# Altium schematic sheet top_power.SchDoc: Electrical Power System - General Block Diagram - Power
size A3; Date: 2015-08-29; Author: Piotr Kuligowski; Revision: 1-0; SheetNumber: 1; SheetTotal: 8; Model: EM1; PageSetup: Record=PageOptions|CenterHorizontal=True|CenterVertical=True|PrintScale=0.52|XCorrection=1.00|YCorrection=1.00|PrintKind=1|BorderSize=5000000|LeftOffset=0|BottomOffset=0|Orientation=2|PaperLength=4200|PaperWidth=2970|Scale=100|PaperSource=7|PrintQuality=600|MediaType=1|DitherType=10|PaperKind=A3|PrintScaleMode=1
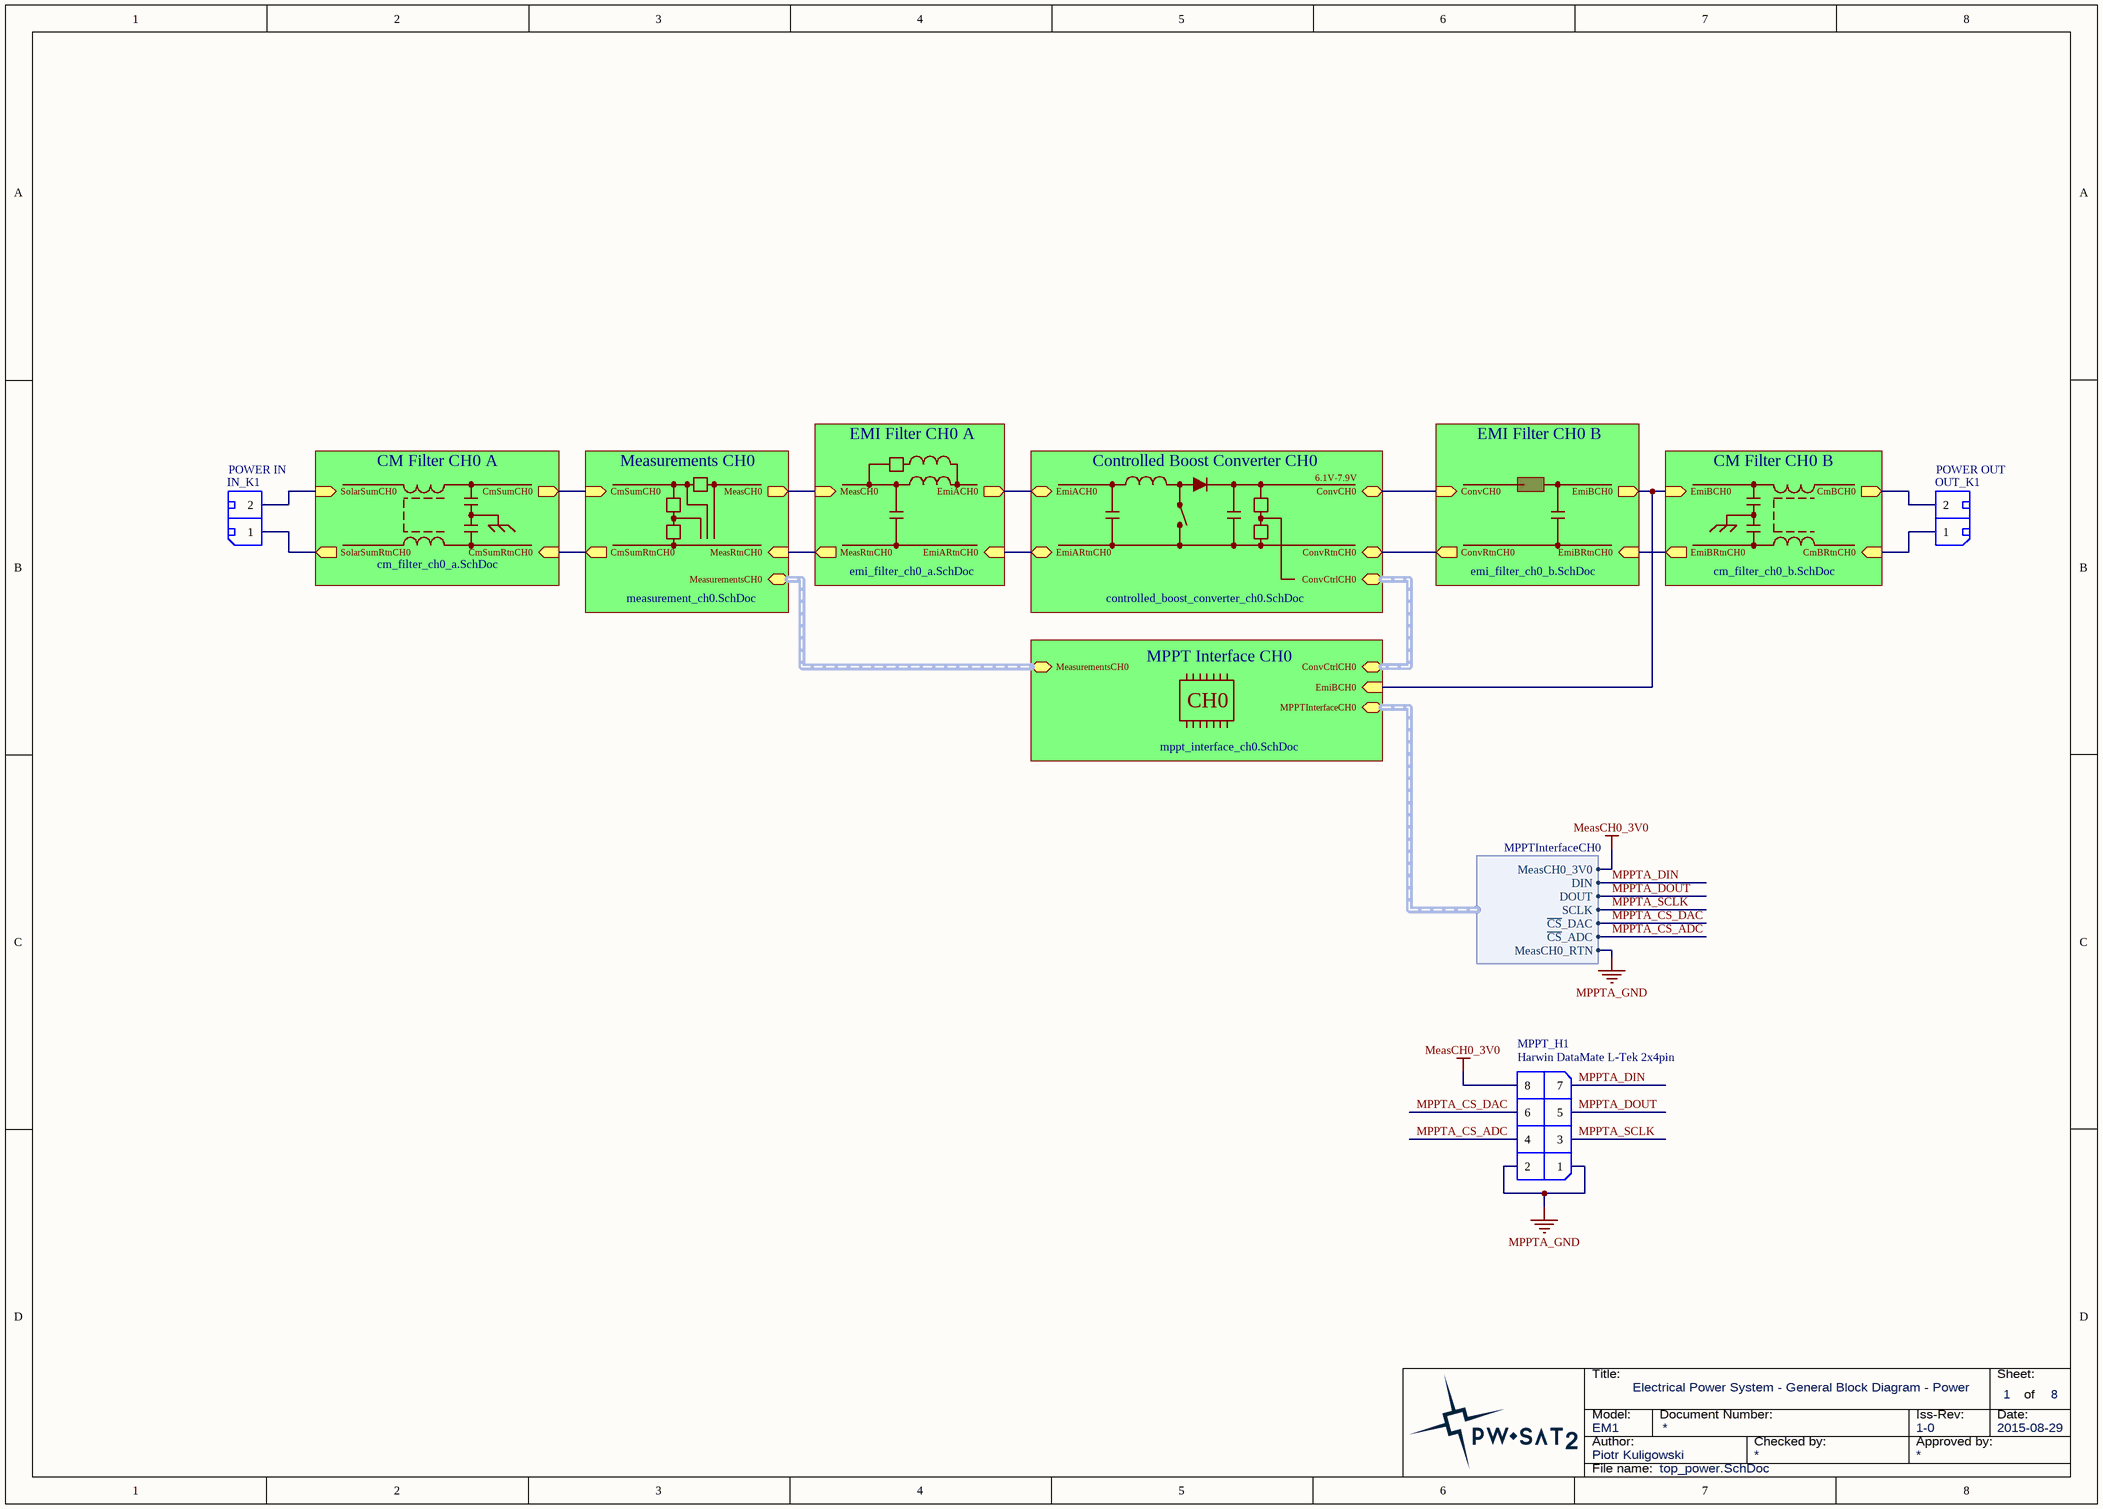
[diagram p0: top_power.SchDoc]

## Parts
IN_K1  ProviderPartNumber: POWER IN  [TerminalBlock_Spring_2.54_2-R]  (hidden comment: TB-2.5-PD-xx)
MPPT_H1  Harwin DataMate L-Tek 2x4pin  [Harwin_Datamate_L-Tek_M80-8670805]
OUT_K1  ProviderPartNumber: POWER OUT  [TerminalBlock_Spring_2.54_2-R]  (hidden comment: TB-2.5-PD-xx)

## Sub-sheets
CM Filter CH0 A = cm_filter_ch0_a.SchDoc: CmSumCH0 (out), CmSumRtnCH0 (in), SolarSumCH0 (in), SolarSumRtnCH0 (out)
CM Filter CH0 B = cm_filter_ch0_b.SchDoc: CmBCH0 (out), CmBRtnCH0 (in), EmiBCH0 (in), EmiBRtnCH0 (out)
Controlled Boost Converter CH0 = controlled_boost_converter_ch0.SchDoc: ConvCH0, ConvRtnCH0, EmiACH0, EmiARtnCH0, ConvCtrlCH0 (harness ConvCtrlCH0)
EMI Filter CH0 A = emi_filter_ch0_a.SchDoc: EmiACH0 (out), EmiARtnCH0 (in), MeasCH0 (in), MeasRtnCH0 (out)
EMI Filter CH0 B = emi_filter_ch0_b.SchDoc: EmiBCH0 (out), EmiBRtnCH0 (in), ConvCH0 (in), ConvRtnCH0 (out)
Measurements CH0 = measurement_ch0.SchDoc: MeasCH0 (out), MeasRtnCH0 (in), CmSumCH0 (in), CmSumRtnCH0 (out), MeasurementsCH0 (harness MeasurementsCH0)
MPPT Interface CH0 = mppt_interface_ch0.SchDoc: MeasurementsCH0 (harness MeasurementsCH0), ConvCtrlCH0 (harness ConvCtrlCH0), MPPTInterfaceCH0 (harness MPPTInterfaceCH0), EmiBCH0 (in)

## Harnesses
MPPTInterfaceCH0: DIN, DOUT, SCLK, ~{CS}_DAC, ~{CS}_ADC, MeasCH0_3V0, MeasCH0_RTN

## Nets
MeasCH0_3V0: MPPT_H1.8 ; sheet MPPT Interface CH0/MPPTInterfaceCH0.MeasCH0_3V0
MPPTA_GND: MPPT_H1.1 MPPT_H1.2 ; sheet MPPT Interface CH0/MPPTInterfaceCH0.MeasCH0_RTN
MPPTA_CS_ADC: MPPT_H1.4 ; sheet MPPT Interface CH0/MPPTInterfaceCH0.~{CS}_ADC
MPPTA_CS_DAC: MPPT_H1.6 ; sheet MPPT Interface CH0/MPPTInterfaceCH0.~{CS}_DAC
MPPTA_DIN: MPPT_H1.7 ; sheet MPPT Interface CH0/MPPTInterfaceCH0.DIN
MPPTA_DOUT: MPPT_H1.5 ; sheet MPPT Interface CH0/MPPTInterfaceCH0.DOUT
MPPTA_SCLK: MPPT_H1.3 ; sheet MPPT Interface CH0/MPPTInterfaceCH0.SCLK
NetIN_K1_1: IN_K1.1 ; sheet CM Filter CH0 A/SolarSumRtnCH0
NetIN_K1_2: IN_K1.2 ; sheet CM Filter CH0 A/SolarSumCH0
NetOUT_K1_1: OUT_K1.1 ; sheet CM Filter CH0 B/CmBRtnCH0
NetOUT_K1_2: OUT_K1.2 ; sheet CM Filter CH0 B/CmBCH0
(unnamed): sheet Controlled Boost Converter CH0/ConvCH0, sheet EMI Filter CH0 B/ConvCH0
(unnamed): sheet Controlled Boost Converter CH0/ConvRtnCH0, sheet EMI Filter CH0 B/ConvRtnCH0
(unnamed): sheet Controlled Boost Converter CH0/EmiACH0, sheet EMI Filter CH0 A/EmiACH0
(unnamed): sheet Controlled Boost Converter CH0/EmiARtnCH0, sheet EMI Filter CH0 A/EmiARtnCH0
(unnamed): sheet CM Filter CH0 A/CmSumCH0, sheet Measurements CH0/CmSumCH0
(unnamed): sheet CM Filter CH0 A/CmSumRtnCH0, sheet Measurements CH0/CmSumRtnCH0
(unnamed): sheet MPPT Interface CH0/EmiBCH0, sheet EMI Filter CH0 B/EmiBCH0, sheet CM Filter CH0 B/EmiBCH0
(unnamed): sheet Measurements CH0/MeasCH0, sheet EMI Filter CH0 A/MeasCH0
(unnamed): sheet Measurements CH0/MeasRtnCH0, sheet EMI Filter CH0 A/MeasRtnCH0
(unnamed): sheet EMI Filter CH0 B/EmiBRtnCH0, sheet CM Filter CH0 B/EmiBRtnCH0

## Buses and harness runs
harness sheet Controlled Boost Converter CH0/ConvCtrlCH0 = sheet MPPT Interface CH0/ConvCtrlCH0
harness sheet Measurements CH0/MeasurementsCH0 = sheet MPPT Interface CH0/MeasurementsCH0

## Notes on the sheet
- 6.1V-7.9V
- CH0
- Title:
- Sheet:
- of
- Author:
- Model:
- Document Number:
- Checked by:
- Iss-Rev:
- Approved by:
- Date:
- File name:

## Library data of the parts
IN_K1 OUT_K1 = TerminalBlock_Spring_2.54_2-R: Terminal block with spring, 2-pin, 2.54mm pitch, right angle.; Provider: TME.eu; Value: TB-2.5-PD-xx
MPPT_H1 = Harwin_Datamate_L-Tek_2x4pin: Harwin DataMate L-Tek, 2mm pitch, 2x4pin.; Value: Harwin DataMate L-Tek 2x4pin